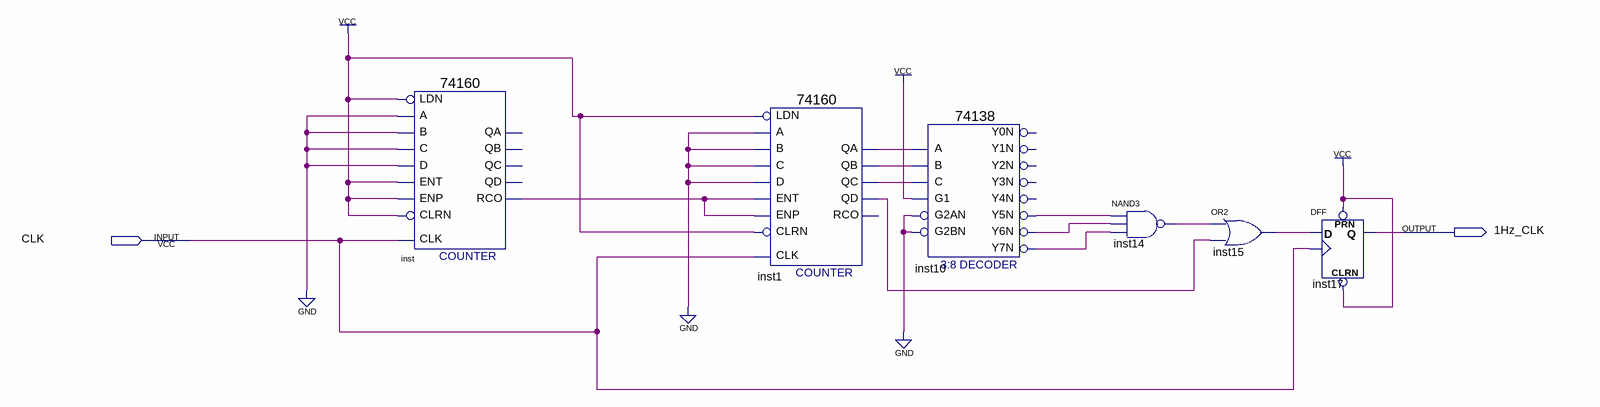
[diagram p0: schematic sheet]
// Quartus schematic Block8.bdf as structural Verilog: 6 symbols, 2 pins
module Block8 (
  input  CLK,
  output \1Hz_CLK 
);

  wire inst1_qa, inst1_qb, inst1_qc, inst1_qd, inst10_y5n, inst10_y6n, inst10_y7n, inst14_out, inst15_out,
       inst_rco;

  \74160  inst (
    .CLK(CLK), .ENT(1'b1), .A(1'b0), .B(1'b0), .C(1'b0), .D(1'b0), .LDN(1'b1), .ENP(1'b1), .CLRN(1'b1),
    .RCO(inst_rco));  // open: QD, QA, QB, QC
  \74160  inst1 (
    .CLK(CLK), .ENT(inst_rco), .A(1'b0), .B(1'b0), .C(1'b0), .D(1'b0), .LDN(1'b1), .ENP(inst_rco),
    .CLRN(1'b1), .QD(inst1_qd), .QA(inst1_qa), .QB(inst1_qb), .QC(inst1_qc));  // open: RCO
  \74138  inst10 (
    .A(inst1_qa), .B(inst1_qb), .G1(1'b1), .C(inst1_qc), .G2AN(1'b0), .G2BN(1'b0), .Y5N(inst10_y5n),
    .Y6N(inst10_y6n), .Y7N(inst10_y7n));  // open: Y0N, Y1N, Y2N, Y3N, Y4N
  nand inst14 (inst14_out, inst10_y5n, inst10_y6n, inst10_y7n);
  or inst15 (inst15_out, inst14_out, inst1_qd);
  DFF inst17 (.CLRN(1'b1), .CLK(CLK), .D(inst15_out), .PRN(1'b1), .Q(\1Hz_CLK ));
endmodule
